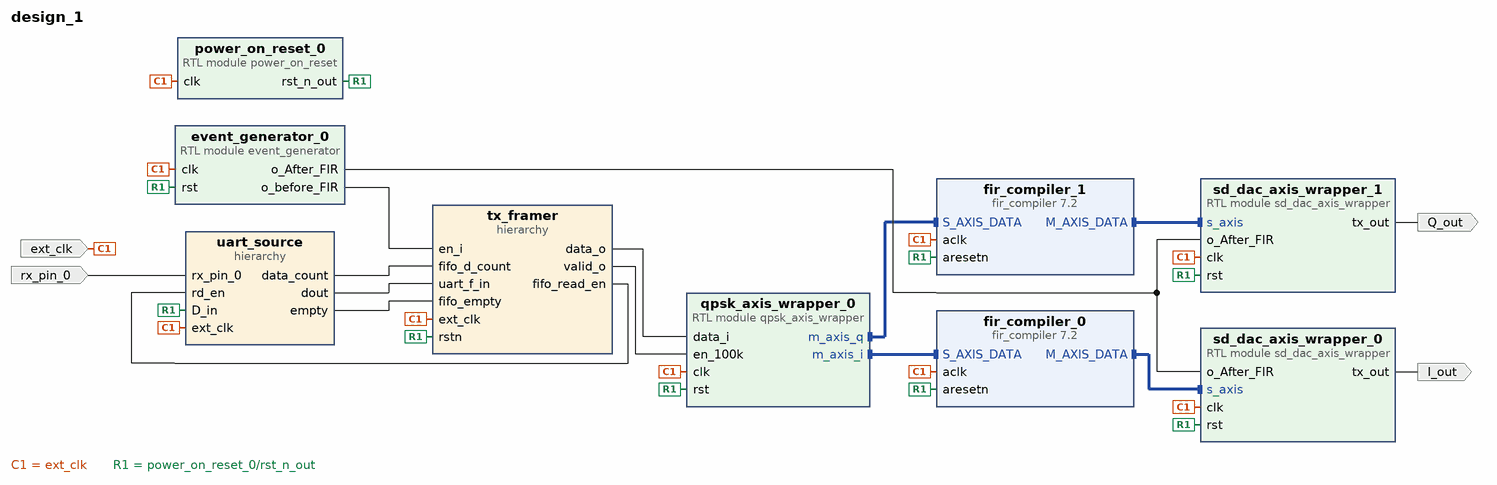
[diagram p0: block diagram of the top level]
# Vivado block design design_1, xc7z020clg400-1, Vivado 2023.2
create_bd_design design_1

create_bd_port -dir I -type clk ext_clk
set_property -dict {CONFIG.FREQ_HZ 36000000} [get_bd_ports ext_clk]
create_bd_port -dir O -type data I_out
create_bd_port -dir O -type data Q_out
create_bd_port -dir I rx_pin_0

create_bd_cell -type module -reference qpsk_axis_wrapper qpsk_axis_wrapper_0
create_bd_cell -type module -reference event_generator event_generator_0
create_bd_cell -type ip -vlnv xilinx.com:ip:fir_compiler:7.2 fir_compiler_0
set_property -dict [list \
  CONFIG.Clock_Frequency 36.0 \
  CONFIG.CoefficientSource COE_File \
  CONFIG.CoefficientVector -0.0003126884694211185,0.000594990502577275,0.000911697861738503,0.00027832965133711696,-0.0006818522233515978,-0.0009590689442120492,-0.00020107609452679753,0.0008653303957544267,0.0011241231113672256,0.00022296012321021408,-0.0009939891751855612,-0.001283859834074974,-0.0002842420944944024,0.0010397827718406916,0.0013164483243599534,0.00018905434990301728,-0.001226105378009379,-0.0014094192301854491,-2.853495789167937e-05,0.0015944872284308076,0.001736433943733573,7.240756531246006e-05,-0.0018396283267065883,-0.0020289786625653505,-0.0001631866325624287,0.0019437499577179551,0.0020600890275090933,-0.0001130206510424614,-0.002414371119812131,-0.002282136818394065,0.0005140104913152754,0.0033202217891812325,0.0030841920524835587,-0.00040726325823925436,-0.003916014451533556,-0.003767081769183278,0.00026085879653692245,0.0042324373498559,0.0037521834019571543,-0.0012816610978916287,-0.005855466704815626,-0.0044904472306370735,0.002749327104538679,0.009186851792037487,0.007500374224036932,-0.0023770523257553577,-0.011623112484812737,-0.010267563164234161,0.0020423932000994682,0.01331624761223793,0.009569491259753704,-0.009546198882162571,-0.025446001440286636,-0.014770708978176117,0.02560727298259735,0.06532469391822815,0.05710208788514137,-0.022065982222557068,-0.1351233720779419,-0.18857620656490326,-0.0846647396683693,0.20680885016918182,0.60759037733078,0.9568374752998352,1.0953036546707153,0.9568374752998352,0.60759037733078,0.20680885016918182,-0.0846647396683693,-0.18857620656490326,-0.1351233720779419,-0.022065982222557068,0.05710208788514137,0.06532469391822815,0.02560727298259735,-0.014770708978176117,-0.025446001440286636,-0.009546198882162571,0.009569491259753704,0.01331624761223793,0.0020423932000994682,-0.010267563164234161,-0.011623112484812737,-0.0023770523257553577,0.007500374224036932,0.009186851792037487,0.002749327104538679,-0.0044904472306370735,-0.005855466704815626,-0.0012816610978916287,0.0037521834019571543,0.0042324373498559,0.00026085879653692245,-0.003767081769183278,-0.003916014451533556,-0.00040726325823925436,0.0030841920524835587,0.0033202217891812325,0.0005140104913152754,-0.002282136818394065,-0.002414371119812131,-0.0001130206510424614,0.0020600890275090933,0.0019437499577179551,-0.0001631866325624287,-0.0020289786625653505,-0.0018396283267065883,7.240756531246006e-05,0.001736433943733573,0.0015944872284308076,-2.853495789167937e-05,-0.0014094192301854491,-0.001226105378009379,0.00018905434990301728,0.0013164483243599534,0.0010397827718406916,-0.0002842420944944024,-0.001283859834074974,-0.0009939891751855612,0.00022296012321021408,0.0011241231113672256,0.0008653303957544267,-0.00020107609452679753,-0.0009590689442120492,-0.0006818522233515978,0.00027832965133711696,0.000911697861738503,0.000594990502577275,-0.0003126884694211185 \
  CONFIG.Coefficient_File ../../ip/rrc_0p35_4x_129tap.coe \
  CONFIG.Coefficient_Fractional_Bits 14 \
  CONFIG.Coefficient_Sets 1 \
  CONFIG.Coefficient_Sign Signed \
  CONFIG.Coefficient_Structure Inferred \
  CONFIG.Coefficient_Width 16 \
  CONFIG.Decimation_Rate 1 \
  CONFIG.Filter_Architecture Systolic_Multiply_Accumulate \
  CONFIG.Filter_Type Interpolation \
  CONFIG.Has_ARESETn true \
  CONFIG.Interpolation_Rate 4 \
  CONFIG.M_DATA_Has_TREADY true \
  CONFIG.Number_Channels 1 \
  CONFIG.Output_Rounding_Mode Full_Precision \
  CONFIG.Output_Width 31 \
  CONFIG.Quantization Quantize_Only \
  CONFIG.RateSpecification Frequency_Specification \
  CONFIG.Sample_Frequency 0.1 \
  CONFIG.Zero_Pack_Factor 1 \
] [get_bd_cells fir_compiler_0]
create_bd_cell -type module -reference sd_dac_axis_wrapper sd_dac_axis_wrapper_0
create_bd_cell -type ip -vlnv xilinx.com:ip:fir_compiler:7.2 fir_compiler_1
set_property -dict [list \
  CONFIG.Clock_Frequency 36.0 \
  CONFIG.CoefficientSource COE_File \
  CONFIG.CoefficientVector -0.0003126884694211185,0.000594990502577275,0.000911697861738503,0.00027832965133711696,-0.0006818522233515978,-0.0009590689442120492,-0.00020107609452679753,0.0008653303957544267,0.0011241231113672256,0.00022296012321021408,-0.0009939891751855612,-0.001283859834074974,-0.0002842420944944024,0.0010397827718406916,0.0013164483243599534,0.00018905434990301728,-0.001226105378009379,-0.0014094192301854491,-2.853495789167937e-05,0.0015944872284308076,0.001736433943733573,7.240756531246006e-05,-0.0018396283267065883,-0.0020289786625653505,-0.0001631866325624287,0.0019437499577179551,0.0020600890275090933,-0.0001130206510424614,-0.002414371119812131,-0.002282136818394065,0.0005140104913152754,0.0033202217891812325,0.0030841920524835587,-0.00040726325823925436,-0.003916014451533556,-0.003767081769183278,0.00026085879653692245,0.0042324373498559,0.0037521834019571543,-0.0012816610978916287,-0.005855466704815626,-0.0044904472306370735,0.002749327104538679,0.009186851792037487,0.007500374224036932,-0.0023770523257553577,-0.011623112484812737,-0.010267563164234161,0.0020423932000994682,0.01331624761223793,0.009569491259753704,-0.009546198882162571,-0.025446001440286636,-0.014770708978176117,0.02560727298259735,0.06532469391822815,0.05710208788514137,-0.022065982222557068,-0.1351233720779419,-0.18857620656490326,-0.0846647396683693,0.20680885016918182,0.60759037733078,0.9568374752998352,1.0953036546707153,0.9568374752998352,0.60759037733078,0.20680885016918182,-0.0846647396683693,-0.18857620656490326,-0.1351233720779419,-0.022065982222557068,0.05710208788514137,0.06532469391822815,0.02560727298259735,-0.014770708978176117,-0.025446001440286636,-0.009546198882162571,0.009569491259753704,0.01331624761223793,0.0020423932000994682,-0.010267563164234161,-0.011623112484812737,-0.0023770523257553577,0.007500374224036932,0.009186851792037487,0.002749327104538679,-0.0044904472306370735,-0.005855466704815626,-0.0012816610978916287,0.0037521834019571543,0.0042324373498559,0.00026085879653692245,-0.003767081769183278,-0.003916014451533556,-0.00040726325823925436,0.0030841920524835587,0.0033202217891812325,0.0005140104913152754,-0.002282136818394065,-0.002414371119812131,-0.0001130206510424614,0.0020600890275090933,0.0019437499577179551,-0.0001631866325624287,-0.0020289786625653505,-0.0018396283267065883,7.240756531246006e-05,0.001736433943733573,0.0015944872284308076,-2.853495789167937e-05,-0.0014094192301854491,-0.001226105378009379,0.00018905434990301728,0.0013164483243599534,0.0010397827718406916,-0.0002842420944944024,-0.001283859834074974,-0.0009939891751855612,0.00022296012321021408,0.0011241231113672256,0.0008653303957544267,-0.00020107609452679753,-0.0009590689442120492,-0.0006818522233515978,0.00027832965133711696,0.000911697861738503,0.000594990502577275,-0.0003126884694211185 \
  CONFIG.Coefficient_File ../../ip/rrc_0p35_4x_129tap.coe \
  CONFIG.Coefficient_Fractional_Bits 14 \
  CONFIG.Coefficient_Sets 1 \
  CONFIG.Coefficient_Sign Signed \
  CONFIG.Coefficient_Structure Inferred \
  CONFIG.Coefficient_Width 16 \
  CONFIG.Decimation_Rate 1 \
  CONFIG.Filter_Architecture Systolic_Multiply_Accumulate \
  CONFIG.Filter_Type Interpolation \
  CONFIG.Has_ARESETn true \
  CONFIG.Interpolation_Rate 4 \
  CONFIG.M_DATA_Has_TREADY true \
  CONFIG.Number_Channels 1 \
  CONFIG.Output_Rounding_Mode Full_Precision \
  CONFIG.Output_Width 31 \
  CONFIG.Quantization Quantize_Only \
  CONFIG.RateSpecification Frequency_Specification \
  CONFIG.Sample_Frequency 0.1 \
  CONFIG.Zero_Pack_Factor 1 \
] [get_bd_cells fir_compiler_1]
create_bd_cell -type module -reference sd_dac_axis_wrapper sd_dac_axis_wrapper_1
create_bd_cell -type module -reference power_on_reset power_on_reset_0
create_bd_cell -type hier tx_framer
create_bd_cell -type hier uart_source

# ---- hierarchy /tx_framer ----
current_bd_instance /tx_framer
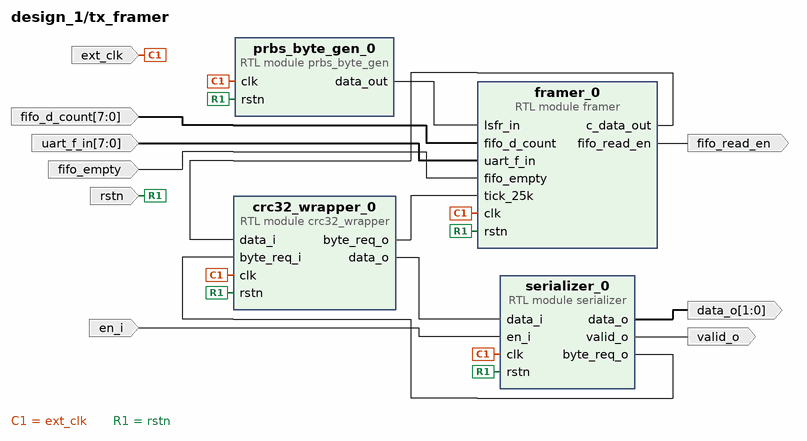
[diagram p1: block diagram inside /tx_framer]
create_bd_pin -dir I -type clk ext_clk
create_bd_pin -dir I -type rst rstn
create_bd_pin -dir I en_i
create_bd_pin -dir O valid_o
create_bd_pin -dir O -from 1 -to 0 data_o
create_bd_pin -dir I -from 7 -to 0 uart_f_in
create_bd_pin -dir I fifo_empty
create_bd_pin -dir I -from 7 -to 0 fifo_d_count
create_bd_pin -dir O fifo_read_en

create_bd_cell -type module -reference serializer serializer_0
create_bd_cell -type module -reference crc32_wrapper crc32_wrapper_0
create_bd_cell -type module -reference framer framer_0
create_bd_cell -type module -reference prbs_byte_gen prbs_byte_gen_0

# ---- hierarchy /uart_source ----
current_bd_instance /uart_source
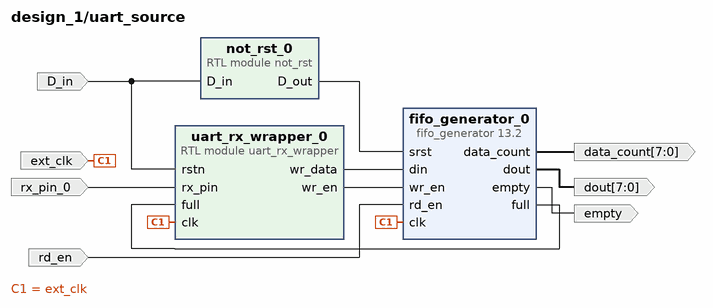
[diagram p2: block diagram inside /uart_source]
create_bd_pin -dir I -type clk ext_clk
create_bd_pin -dir I rd_en
create_bd_pin -dir O -from 7 -to 0 dout
create_bd_pin -dir O empty
create_bd_pin -dir O -from 7 -to 0 data_count
create_bd_pin -dir I D_in
create_bd_pin -dir I rx_pin_0

create_bd_cell -type ip -vlnv xilinx.com:ip:fifo_generator:13.2 fifo_generator_0
set_property -dict [list \
  CONFIG.Data_Count true \
  CONFIG.Fifo_Implementation Common_Clock_Block_RAM \
  CONFIG.Input_Data_Width 8 \
  CONFIG.Input_Depth 128 \
  CONFIG.Performance_Options First_Word_Fall_Through \
] [get_bd_cells fifo_generator_0]
create_bd_cell -type module -reference uart_rx_wrapper uart_rx_wrapper_0
create_bd_cell -type module -reference not_rst not_rst_0

# ---- connections ----

current_bd_instance /tx_framer
connect_bd_net [get_bd_pins crc32_wrapper_0/byte_req_o] [get_bd_pins framer_0/tick_25k]
connect_bd_net [get_bd_pins crc32_wrapper_0/data_o] [get_bd_pins serializer_0/data_i]
connect_bd_net -net event_generator_0_o_before_FIR [get_bd_pins en_i] [get_bd_pins serializer_0/en_i]
connect_bd_net [get_bd_pins ext_clk] \
  [get_bd_pins framer_0/clk] [get_bd_pins prbs_byte_gen_0/clk] [get_bd_pins crc32_wrapper_0/clk] \
  [get_bd_pins serializer_0/clk]
connect_bd_net -net fifo_generator_0_data_count [get_bd_pins fifo_d_count] [get_bd_pins framer_0/fifo_d_count]
connect_bd_net -net fifo_generator_0_dout [get_bd_pins uart_f_in] [get_bd_pins framer_0/uart_f_in]
connect_bd_net -net fifo_generator_0_empty [get_bd_pins fifo_empty] [get_bd_pins framer_0/fifo_empty]
connect_bd_net [get_bd_pins framer_0/c_data_out] [get_bd_pins crc32_wrapper_0/data_i]
connect_bd_net [get_bd_pins framer_0/fifo_read_en] [get_bd_pins fifo_read_en]
connect_bd_net [get_bd_pins prbs_byte_gen_0/data_out] [get_bd_pins framer_0/lsfr_in]
connect_bd_net [get_bd_pins serializer_0/byte_req_o] [get_bd_pins crc32_wrapper_0/byte_req_i]
connect_bd_net [get_bd_pins serializer_0/data_o] [get_bd_pins data_o]
connect_bd_net [get_bd_pins serializer_0/valid_o] [get_bd_pins valid_o]
connect_bd_net -net xpm_cdc_gen_0_dest_out [get_bd_pins rstn] \
  [get_bd_pins framer_0/rstn] [get_bd_pins prbs_byte_gen_0/rstn] [get_bd_pins crc32_wrapper_0/rstn] \
  [get_bd_pins serializer_0/rstn]

current_bd_instance /uart_source
connect_bd_net [get_bd_pins ext_clk] [get_bd_pins uart_rx_wrapper_0/clk] [get_bd_pins fifo_generator_0/clk]
connect_bd_net [get_bd_pins fifo_generator_0/data_count] [get_bd_pins data_count]
connect_bd_net [get_bd_pins fifo_generator_0/dout] [get_bd_pins dout]
connect_bd_net [get_bd_pins fifo_generator_0/empty] [get_bd_pins empty]
connect_bd_net [get_bd_pins fifo_generator_0/full] [get_bd_pins uart_rx_wrapper_0/full]
connect_bd_net -net framer_0_fifo_read_en [get_bd_pins rd_en] [get_bd_pins fifo_generator_0/rd_en]
connect_bd_net [get_bd_pins not_rst_0/D_out] [get_bd_pins fifo_generator_0/srst]
connect_bd_net -net rx_pin_0_1 [get_bd_pins rx_pin_0] [get_bd_pins uart_rx_wrapper_0/rx_pin]
connect_bd_net [get_bd_pins uart_rx_wrapper_0/wr_data] [get_bd_pins fifo_generator_0/din]
connect_bd_net [get_bd_pins uart_rx_wrapper_0/wr_en] [get_bd_pins fifo_generator_0/wr_en]
connect_bd_net -net xpm_cdc_gen_0_dest_out [get_bd_pins D_in] [get_bd_pins not_rst_0/D_in] [get_bd_pins uart_rx_wrapper_0/rstn]

current_bd_instance /
connect_bd_intf_net [get_bd_intf_pins fir_compiler_0/M_AXIS_DATA] [get_bd_intf_pins sd_dac_axis_wrapper_0/s_axis]
connect_bd_intf_net [get_bd_intf_pins sd_dac_axis_wrapper_1/s_axis] [get_bd_intf_pins fir_compiler_1/M_AXIS_DATA]
connect_bd_intf_net [get_bd_intf_pins qpsk_axis_wrapper_0/m_axis_i] [get_bd_intf_pins fir_compiler_0/S_AXIS_DATA]
connect_bd_intf_net [get_bd_intf_pins qpsk_axis_wrapper_0/m_axis_q] [get_bd_intf_pins fir_compiler_1/S_AXIS_DATA]
connect_bd_net [get_bd_pins event_generator_0/o_After_FIR] \
  [get_bd_pins sd_dac_axis_wrapper_0/o_After_FIR] [get_bd_pins sd_dac_axis_wrapper_1/o_After_FIR]
connect_bd_net [get_bd_pins event_generator_0/o_before_FIR] [get_bd_pins tx_framer/en_i]
connect_bd_net [get_bd_ports ext_clk] \
  [get_bd_pins event_generator_0/clk] [get_bd_pins fir_compiler_0/aclk] [get_bd_pins fir_compiler_1/aclk] \
  [get_bd_pins power_on_reset_0/clk] [get_bd_pins qpsk_axis_wrapper_0/clk] [get_bd_pins sd_dac_axis_wrapper_0/clk] \
  [get_bd_pins sd_dac_axis_wrapper_1/clk] [get_bd_pins tx_framer/ext_clk] [get_bd_pins uart_source/ext_clk]
connect_bd_net -net fifo_generator_0_data_count [get_bd_pins uart_source/data_count] [get_bd_pins tx_framer/fifo_d_count]
connect_bd_net -net fifo_generator_0_dout [get_bd_pins uart_source/dout] [get_bd_pins tx_framer/uart_f_in]
connect_bd_net -net fifo_generator_0_empty [get_bd_pins uart_source/empty] [get_bd_pins tx_framer/fifo_empty]
connect_bd_net -net framer_0_fifo_read_en [get_bd_pins tx_framer/fifo_read_en] [get_bd_pins uart_source/rd_en]
connect_bd_net -net rx_pin_0_1 [get_bd_ports rx_pin_0] [get_bd_pins uart_source/rx_pin_0]
connect_bd_net [get_bd_pins sd_dac_axis_wrapper_0/tx_out] [get_bd_ports I_out]
connect_bd_net [get_bd_pins sd_dac_axis_wrapper_1/tx_out] [get_bd_ports Q_out]
connect_bd_net -net serializer_0_data_o [get_bd_pins tx_framer/data_o] [get_bd_pins qpsk_axis_wrapper_0/data_i]
connect_bd_net -net serializer_0_valid_o [get_bd_pins tx_framer/valid_o] [get_bd_pins qpsk_axis_wrapper_0/en_100k]
connect_bd_net -net xpm_cdc_gen_0_dest_out [get_bd_pins power_on_reset_0/rst_n_out] \
  [get_bd_pins fir_compiler_0/aresetn] [get_bd_pins event_generator_0/rst] [get_bd_pins fir_compiler_1/aresetn] \
  [get_bd_pins qpsk_axis_wrapper_0/rst] [get_bd_pins sd_dac_axis_wrapper_0/rst] [get_bd_pins sd_dac_axis_wrapper_1/rst] \
  [get_bd_pins tx_framer/rstn] [get_bd_pins uart_source/D_in]

validate_bd_design
save_bd_design
